# Altium schematic sheet Sheet1.SchDoc
size A4
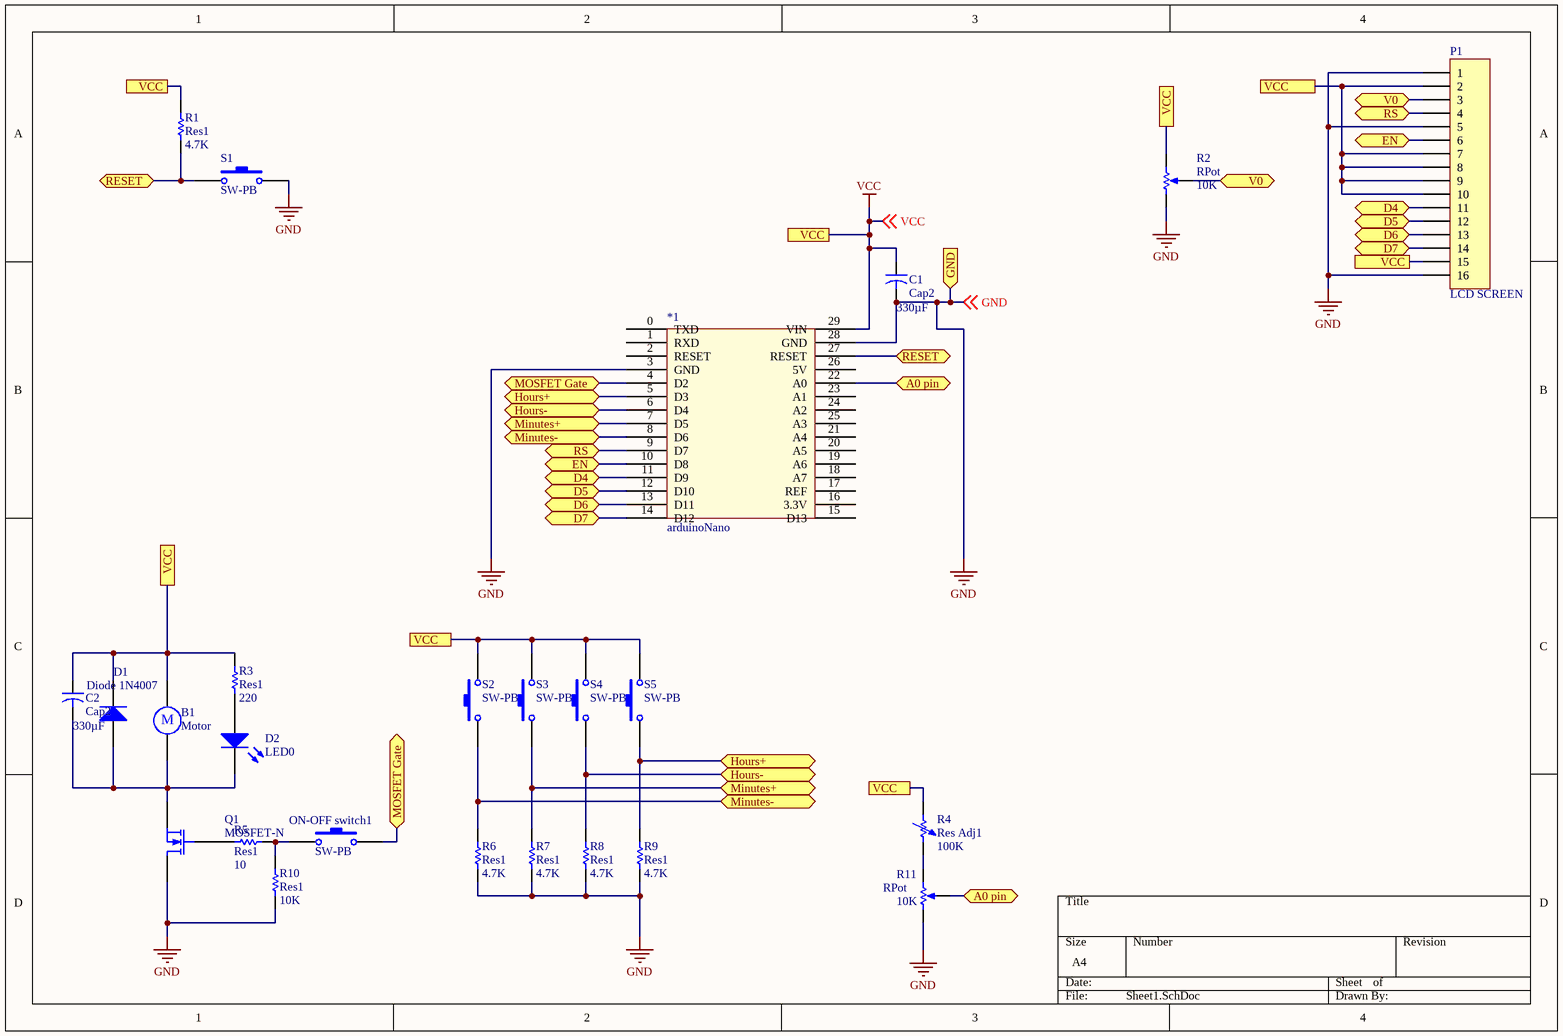
[diagram p0: Sheet1.SchDoc]

## Parts
*1  arduinoNano  [Arduino nano]
B1  Motor  [RB5-10.5]
C1  Cap2  value 330µF  [CAPR5-4X5]
C2  Cap2  value 330µF  [CAPR5-4X5]
D1  Diode 1N4007  [DO-41]
D2  LED0  [LED-0]
ON-OFF_switch1  SW-PB  [SPST-2]
P1  LCD SCREEN  [HDR1X16]
Q1  MOSFET-N  [E3]
R1  Res1  value 4.7K  [AXIAL-0.3]
R2  RPot  value 10K  [VR5]
R3  Res1  value 220  [AXIAL-0.3]
R4  Res Adj1  value 100K  [AXIAL-0.7]
R5  Res1  value 10  [AXIAL-0.3]
R6  Res1  value 4.7K  [AXIAL-0.3]
R7  Res1  value 4.7K  [AXIAL-0.3]
R8  Res1  value 4.7K  [AXIAL-0.3]
R9  Res1  value 4.7K  [AXIAL-0.3]
R10  Res1  value 10K  [AXIAL-0.3]
R11  RPot  value 10K  [VR5]
S1  SW-PB  [SPST-2]
S2  SW-PB  [SPST-2]
S3  SW-PB  [SPST-2]
S4  SW-PB  [SPST-2]
S5  SW-PB  [SPST-2]

## Ports
A0 pin (bidir), D4 (bidir), D5 (bidir), D6 (bidir), D7 (bidir), EN (bidir), GND (in), Hours+ (bidir), Hours- (bidir), Minutes+ (bidir), Minutes- (bidir), MOSFET Gate (bidir), RESET (bidir), RS (bidir), V0 (bidir), VCC

## Nets
GND: *1.3(GND) *1.28(GND) C1.2 P1.1 P1.5 P1.16 Q1.1(D) R2.1(TOP) R6.1 R7.1 R8.1 R9.1 R10.1 R11.1(TOP) S1.2 ; off-sheet GND, port GND
VCC: *1.29(VIN) B1.1 C1.1 C2.1 D1.2(K) P1.2 P1.7 P1.8 P1.9 P1.10 P1.15 R1.2 R2.2(BOT) R3.2 R4.1 S2.2 S3.2 S4.2 S5.2 ; off-sheet VCC, port VCC
A0 pin: *1.22(A0) R11.3(TAP) ; port A0 pin
D4: *1.11(D9) P1.11 ; port D4
D5: *1.12(D10) P1.12 ; port D5
D6: *1.13(D11) P1.13 ; port D6
D7: *1.14(D12) P1.14 ; port D7
EN: *1.10(D8) P1.6 ; port EN
Hours+: *1.5(D3) R9.2 S5.1 ; port Hours+
Hours-: *1.6(D4) R8.2 S4.1 ; port Hours-
Minutes+: *1.7(D5) R7.2 S3.1 ; port Minutes+
Minutes-: *1.8(D6) R6.2 S2.1 ; port Minutes-
MOSFET Gate: *1.4(D2) ON-OFF_switch1.2 ; port MOSFET Gate
RESET: *1.27(RESET) R1.1 S1.1 ; port RESET
RS: *1.9(D7) P1.4 ; port RS
V0: P1.3 R2.3(TAP) ; port V0
NetB1_2: B1.2 C2.2 D1.1(A) D2.2(K) Q1.3(S)
NetD2_1: D2.1(A) R3.1
NetON-OFF_switch1_1: ON-OFF_switch1.1 R5.2 R10.2
NetQ1_2: Q1.2(G) R5.1
NetR4_2: R4.2 R11.2(BOT)

Not connected (* = marked no-connect by the designer): *1 0(TXD) 1(RXD) 2(RESET) 15(D13) 16(3.3V) 17(REF) 18(A7) 19(A6) 20(A5) 21(A4) 23(A1) 24(A2) 25(A3) 26(5V)

## Notes on the sheet
- (in symbol Motor) M

## Library data of the parts
B1 = Motor: Motor, General Kind; Published: 24-Mar-1999; LatestRevisionDate: 17-Jul-2002; LatestRevisionNote: Re-released for DXP Platform.; PackageReference: RB5-10.5; Publisher: Altium Limited; PackageDescription: Capacitor (Radial); 2 Leads
C1 C2 = Cap2: Capacitor; Published: 23-Sep-2002; PackageReference: CAPR5-4X5; Publisher: Altium Limited; PackageDescription: Capacitor; 2 Leads
D1 = Diode 1N4007: 1 Amp General Purpose Rectifier; Published: 8-Jun-2000; LatestRevisionDate: 17-Jul-2002; LatestRevisionNote: Re-released for DXP Platform.; DatasheetVersion: 1998; PackageVersion: Aug-1999; PackageReference: DO-41; Publisher: Altium Limited; PackageDescription: Diode, Axial; Body 5.2 x 2.7 mm (LxDia. max), Lead Dia. 0.86 mm (max); Code_JEDEC: DO-204-AL; ComponentLink1Description: Manufacturer Link; ComponentLink1URL: http://www.fairchildsemi.com/; ComponentLink2Description: Datasheet; ComponentLink2URL: http://www.fairchildsemi.com/ds/1N%2F1N4001.pdf
D2 = LED0: Typical INFRARED GaAs LED; Published: 8-Jun-2000; LatestRevisionDate: 08-Jul-2005; LatestRevisionNote: Mech Layer 1 removed.; PackageReference: LED-0; Publisher: Altium Limited; PackageDescription: LED; 2 Leads
ON-OFF_switch1 S1-S5 = SW-PB: Switch; Published: 24-Mar-1999; LatestRevisionDate: 17-Jul-2002; LatestRevisionNote: Re-released for DXP Platform.; PackageReference: SPST-2; Publisher: Altium Limited; PackageDescription: Switch; 2 Leads
P1 = Header 16: Header, 16-Pin; LatestRevisionDate: 17-Jul-2002; LatestRevisionNote: Re-released for DXP Platform.; Publisher: Altium Limited
Q1 = MOSFET-N: N-Channel MOSFET; Published: 8-Jun-2000; LatestRevisionDate: 17-Jul-2002; LatestRevisionNote: Re-released for DXP Platform.; PackageVersion: 1995/1996; PackageReference: E3; Publisher: Altium Limited; PackageDescription: TO, Flat Index; 3 In-Line, Axial Leads; Body Dia. 4.6mm; Lead Dia. 0.5 mm (max)
R1 R3 R5-R10 = Res1: Resistor; Published: 8-Jun-2000; LatestRevisionDate: 17-Jul-2002; LatestRevisionNote: Re-released for DXP Platform.; PackageReference: AXIAL-0.3; Publisher: Altium Limited; PackageDescription: Axial Device, Thru-Hole; 2 Leads; 0.3 in Pin Spacing
R2 R11 = RPot: Potentiometer; Sim Note: Enter the Resistance value and the set point into parameter fields.; Set Position: 0.5; Published: 8-Jun-2000; LatestRevisionDate: 17-Jul-2002; LatestRevisionNote: Re-released for DXP Platform.; PackageReference: VR5; Publisher: Altium Limited; PackageDescription: Variable Resistor, Thru-Hole; 3 Leads
R4 = Res Adj1: Variable Resistor; Set Position: 0.5; Published: 8-Jun-2000; LatestRevisionDate: 17-Jul-2002; LatestRevisionNote: Re-released for DXP Platform.; PackageReference: AXIAL-0.7; Publisher: Altium Limited; PackageDescription: Axial Device, Thru-Hole; 2 Leads; 0.7 in Pin Spacing